# Altium schematic sheet MOSFETS.SchDoc
size 420 x 297 mm; PageSetup: Record=PageOptions|CenterHorizontal=False|CenterVertical=False|PrintScale=0.95|XCorrection=0.00|YCorrection=0.00|PrintKind=1|BorderSize=5000000|LeftOffset=0|BottomOffset=0|Orientation=1|PaperLength=1000|PaperWidth=1000|Scale=100|PaperSource=15|PrintQuality=600|MediaType=1|DitherType=10|PaperKind=A4|PrintScaleMode=1
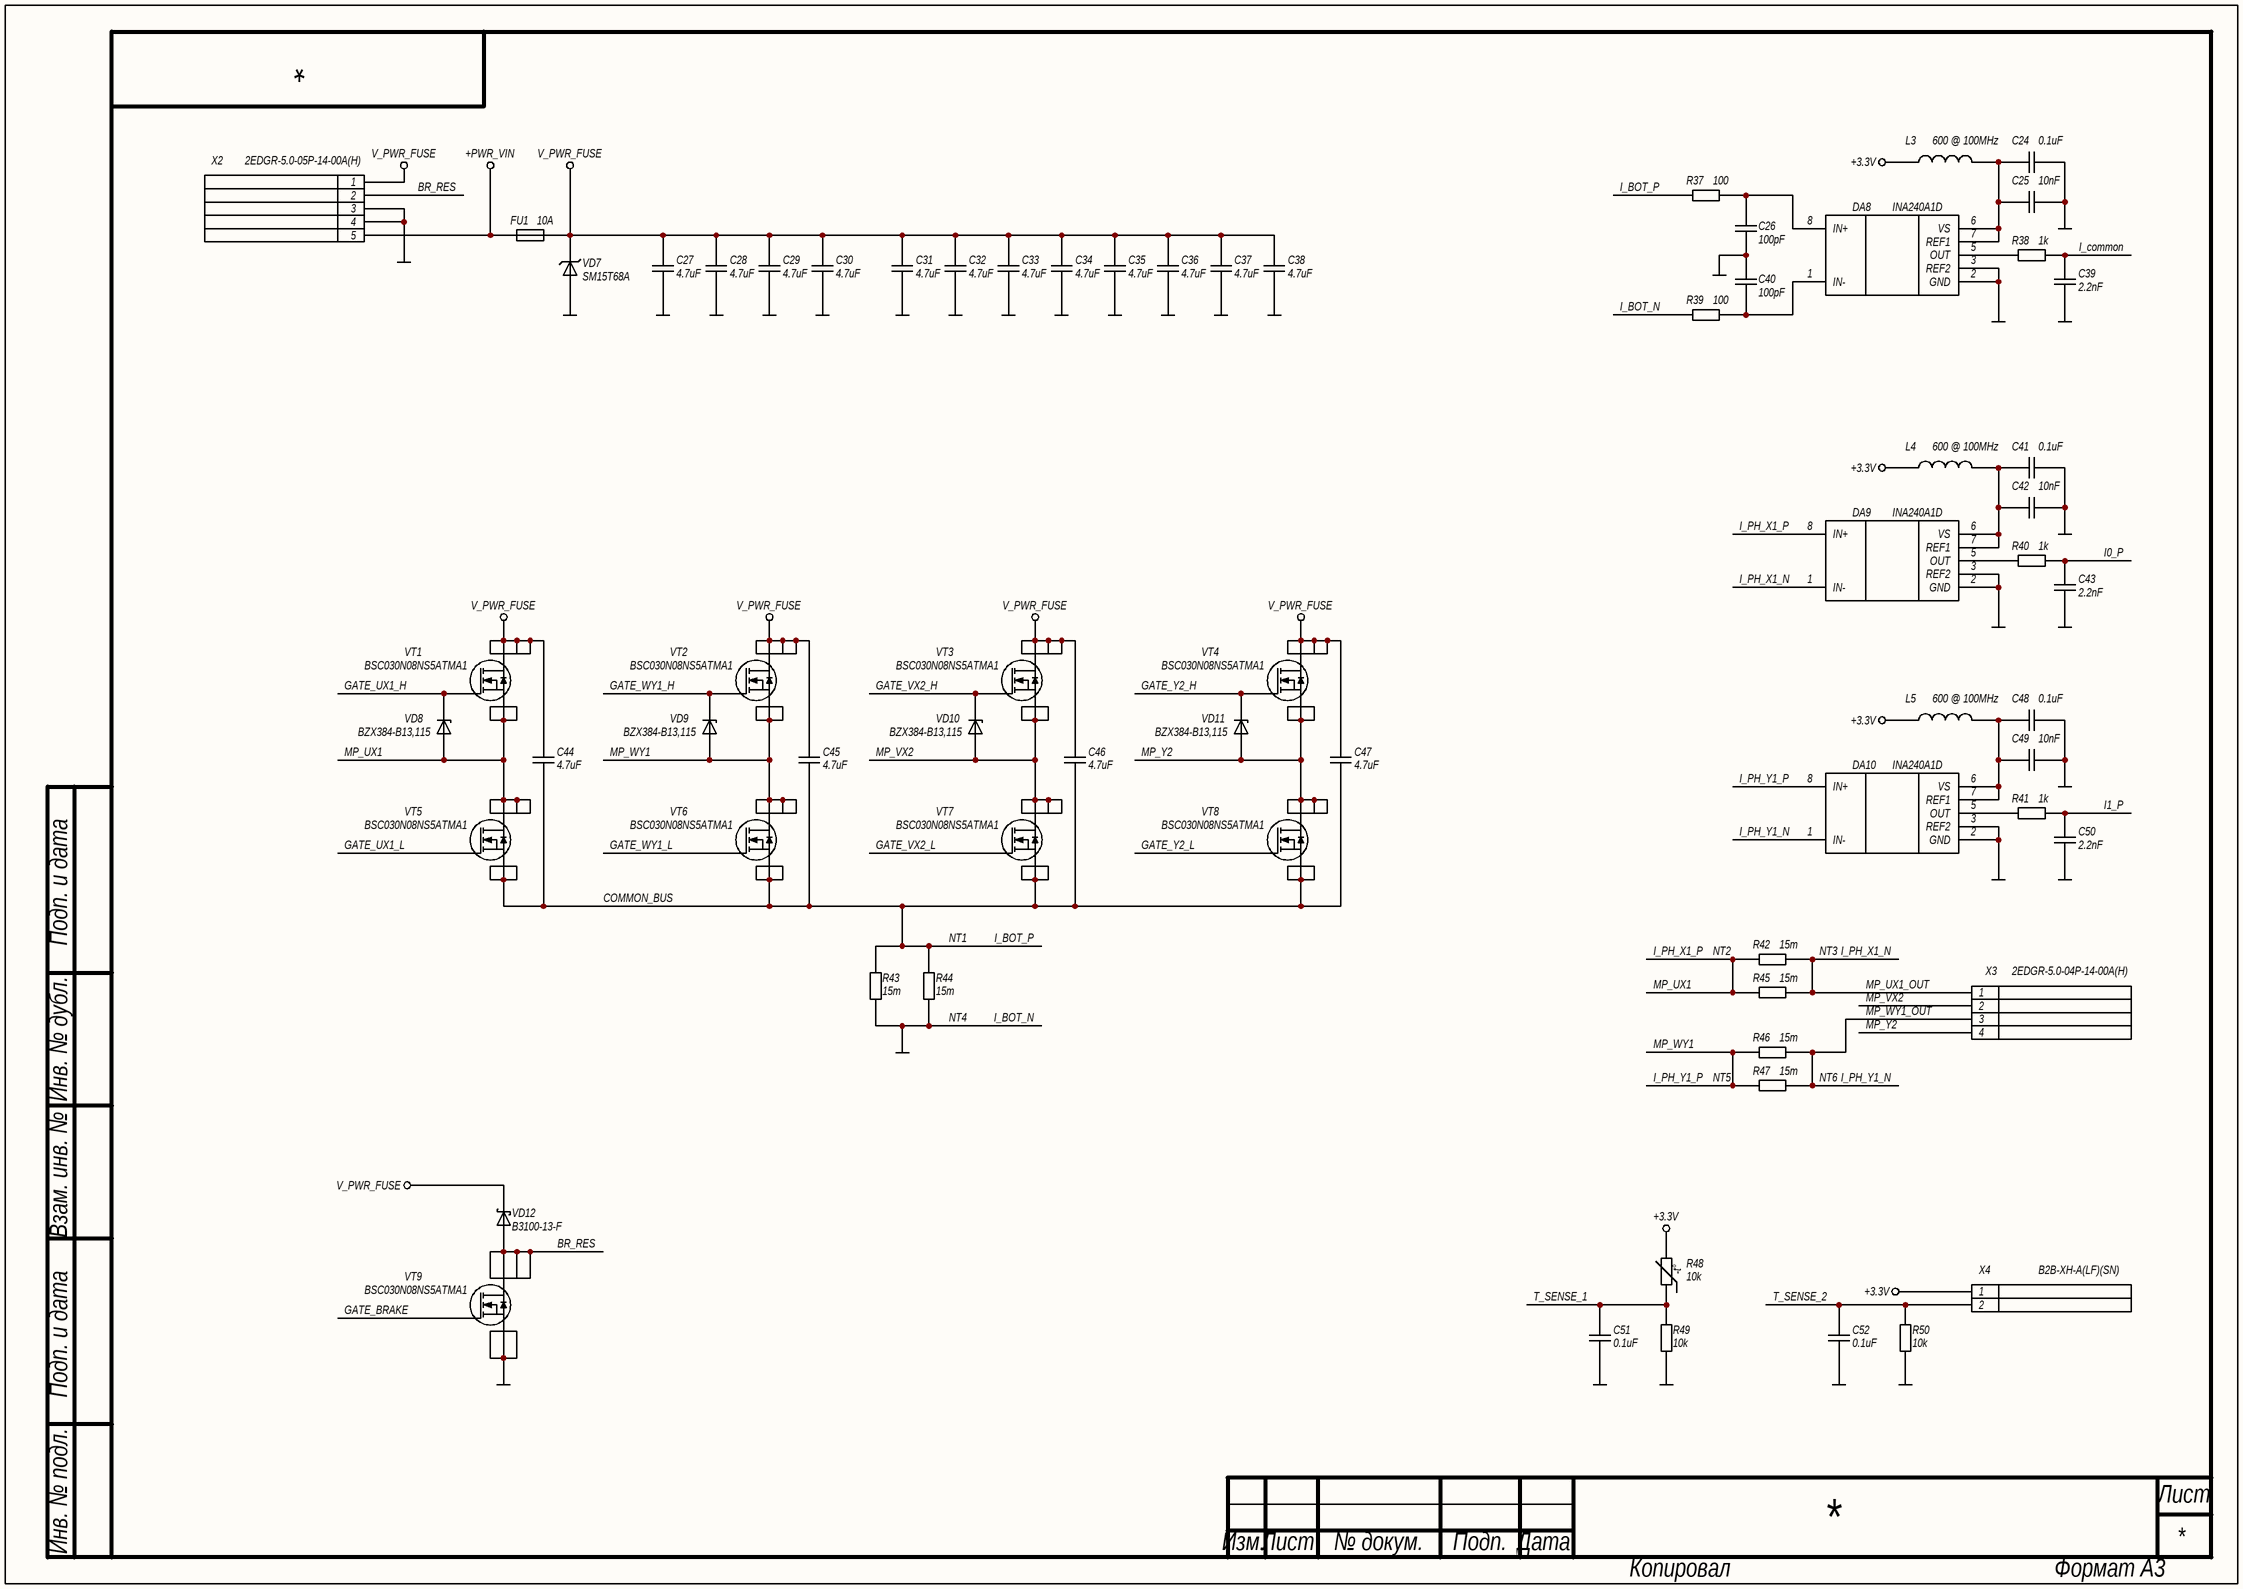
[diagram p0: MOSFETS.SchDoc]

## Parts
C24  0.1uF  [C0603N]
C25  10nF  [C0603N]
C26  100pF  [C0603N]
C27  4.7uF  [C1210N]
C28  4.7uF  [C1210N]
C29  4.7uF  [C1210N]
C30  4.7uF  [C1210N]
C31  4.7uF  [C1210N]
C32  4.7uF  [C1210N]
C33  4.7uF  [C1210N]
C34  4.7uF  [C1210N]
C35  4.7uF  [C1210N]
C36  4.7uF  [C1210N]
C37  4.7uF  [C1210N]
C38  4.7uF  [C1210N]
C39  2.2nF  [C0603N]
C40  100pF  [C0603N]
C41  0.1uF  [C0603N]
C42  10nF  [C0603N]
C43  2.2nF  [C0603N]
C44  4.7uF  [C1210N]
C45  4.7uF  [C1210N]
C46  4.7uF  [C1210N]
C47  4.7uF  [C1210N]
C48  0.1uF  [C0603N]
C49  10nF  [C0603N]
C50  2.2nF  [C0603N]
C51  0.1uF  [C0603N]
C52  0.1uF  [C0603N]
DA8  INA240A1D  [D0008A]
DA9  INA240A1D  [D0008A]
DA10  INA240A1D  [D0008A]
FU1  10A  [0154]
L3  600 @ 100MHz  [FB0603N]
L4  600 @ 100MHz  [FB0603N]
L5  600 @ 100MHz  [FB0603N]
NT1  NET_TIE  [NT_0.125_0.375]  (value not drawn)  (net tie, no BOM)
NT2  NET_TIE  [NT_0.125_0.375]  (value not drawn)  (net tie, no BOM)
NT3  NET_TIE  [NT_0.125_0.375]  (value not drawn)  (net tie, no BOM)
NT4  NET_TIE  [NT_0.125_0.375]  (value not drawn)  (net tie, no BOM)
NT5  NET_TIE  [NT_0.125_0.375]  (value not drawn)  (net tie, no BOM)
NT6  NET_TIE  [NT_0.125_0.375]  (value not drawn)  (net tie, no BOM)
R37  100  [R0603N]
R38  1k  [R0603N]
R39  100  [R0603N]
R40  1k  [R0603N]
R41  1k  [R0603N]
R42  15m  [R2512N]
R43  15m  [R2512N]
R44  15m  [R2512N]
R45  15m  [R2512N]
R46  15m  [R2512N]
R47  15m  [R2512N]
R48  10k  [RT0603N]
R49  10k  [R0603N]
R50  10k  [R0603N]
VD7  SM15T68A  [SMC]
VD8  BZX384-B13,115  [SOD323]
VD9  BZX384-B13,115  [SOD323]
VD10  BZX384-B13,115  [SOD323]
VD11  BZX384-B13,115  [SOD323]
VD12  B3100-13-F  [SMC]
VT1  BSC030N08NS5ATMA1  [PG-TDSON-8]
VT2  BSC030N08NS5ATMA1  [PG-TDSON-8]
VT3  BSC030N08NS5ATMA1  [PG-TDSON-8]
VT4  BSC030N08NS5ATMA1  [PG-TDSON-8]
VT5  BSC030N08NS5ATMA1  [PG-TDSON-8]
VT6  BSC030N08NS5ATMA1  [PG-TDSON-8]
VT7  BSC030N08NS5ATMA1  [PG-TDSON-8]
VT8  BSC030N08NS5ATMA1  [PG-TDSON-8]
VT9  BSC030N08NS5ATMA1  [PG-TDSON-8]
X2  2EDGR-5.0-05P-14-00A(H)  [2EDGR-5.0-05P-14-00A(H)]
X3  2EDGR-5.0-04P-14-00A(H)  [2EDGR-5.0-04P-14-00A(H)]
X4  B2B-XH-A(LF)(SN)  [B2B-XH-A]

## Nets
+3.3V: L3.1 L4.1 L5.1 R48.1 X4.1
+PWR_VIN: FU1.2 X2.5
GND: C24.1 C25.1 C26.2 C27.1 C28.1 C29.1 C30.1 C31.1 C32.1 C33.1 C34.1 C35.1 C36.1 C37.1 C38.1 C39.1 C40.1 C41.1 C42.1 C43.1 C48.1 C49.1 C50.1 C51.2 C52.2 DA8.2(GND) DA8.3(REF2) DA9.2(GND) DA9.3(REF2) DA10.2(GND) DA10.3(REF2) NT4.2 R43.2 R44.2 R49.2 R50.2 VD7.2(A) VT9.1(S) VT9.2(S) VT9.3(S) X2.3 X2.4
V_PWR_FUSE: C27.2 C28.2 C29.2 C30.2 C31.2 C32.2 C33.2 C34.2 C35.2 C36.2 C37.2 C38.2 C44.2 C45.2 C46.2 C47.2 FU1.1 VD7.1(K) VD12.1(K) VT1.5(D) VT1.6(D) VT1.7(D) VT1.8(D) VT2.5(D) VT2.6(D) VT2.7(D) VT2.8(D) VT3.5(D) VT3.6(D) VT3.7(D) VT3.8(D) VT4.5(D) VT4.6(D) VT4.7(D) VT4.8(D) X2.1
BR_RES: VD12.2(A) VT9.5(D) VT9.6(D) VT9.7(D) VT9.8(D) X2.2
COMMON_BUS: C44.1 C45.1 C46.1 C47.1 NT1.2 R43.1 R44.1 VT5.1(S) VT5.2(S) VT5.3(S) VT6.1(S) VT6.2(S) VT6.3(S) VT7.1(S) VT7.2(S) VT7.3(S) VT8.1(S) VT8.2(S) VT8.3(S)
GATE_BRAKE: VT9.4(G)
GATE_UX1_H: VD8.1(K) VT1.4(G)
GATE_UX1_L: VT5.4(G)
GATE_VX2_H: VD10.1(K) VT3.4(G)
GATE_VX2_L: VT7.4(G)
GATE_WY1_H: VD9.1(K) VT2.4(G)
GATE_WY1_L: VT6.4(G)
GATE_Y2_H: VD11.1(K) VT4.4(G)
GATE_Y2_L: VT8.4(G)
I0_P: C43.2 R40.1
I1_P: C50.2 R41.1
I_BOT_N: NT4.1 R39.2
I_BOT_P: NT1.1 R37.2
I_common: C39.2 R38.1
I_PH_X1_N: DA9.1(IN-) NT3.1
I_PH_X1_P: DA9.8(IN+) NT2.2
I_PH_Y1_N: DA10.1(IN-) NT6.1
I_PH_Y1_P: DA10.8(IN+) NT5.2
MP_UX1: NT2.1 R42.2 R45.2 VD8.2(A) VT1.1(S) VT1.2(S) VT1.3(S) VT5.5(D) VT5.6(D) VT5.7(D) VT5.8(D)
MP_UX1_OUT: NT3.2 R42.1 R45.1 X3.1
MP_VX2: VD10.2(A) VT3.1(S) VT3.2(S) VT3.3(S) VT7.5(D) VT7.6(D) VT7.7(D) VT7.8(D) X3.2
MP_WY1: NT5.1 R46.2 R47.2 VD9.2(A) VT2.1(S) VT2.2(S) VT2.3(S) VT6.5(D) VT6.6(D) VT6.7(D) VT6.8(D)
MP_WY1_OUT: NT6.2 R46.1 R47.1 X3.3
MP_Y2: VD11.2(A) VT4.1(S) VT4.2(S) VT4.3(S) VT8.5(D) VT8.6(D) VT8.7(D) VT8.8(D) X3.4
T_SENSE_1: C51.1 R48.2 R49.1
T_SENSE_2: C52.1 R50.1 X4.2
NetC24_2: C24.2 C25.2 DA8.6(VS) DA8.7(REF1) L3.2
NetC26_1: C26.1 DA8.8(IN+) R37.1
NetC40_2: C40.2 DA8.1(IN-) R39.1
NetC41_2: C41.2 C42.2 DA9.6(VS) DA9.7(REF1) L4.2
NetC48_2: C48.2 C49.2 DA10.6(VS) DA10.7(REF1) L5.2
NetDA8_5: DA8.5(OUT) R38.2
NetDA9_5: DA9.5(OUT) R40.2
NetDA10_5: DA10.5(OUT) R41.2

## Notes on the sheet
- Подп. и дата
- Инв. № дубл.
- Взам. инв. №
- Инв. № подл.
- Лист
- Изм.
- № докум.
- Подп.
- Дата
- Копировал
- Формат А3
- (in symbol NCP18XH103F03RB) -t°

## Library data of the parts
C24 C41 C48 C51 C52 = CL10B104KB8NNNC: Конденсатор; Точность: 10%; Напряжение: 50V; Диэлектрик: X7R; Производитель: Samsung Electro-Mechanics; Описание: 0.1 µF ±10% 50V Ceramic Capacitor X7R 0603 (1608 Metric); Корпус: 0603 (1608 Metric); Температурный диапазон: -55°C ~ 125°C; Вид монтажа: SMD; Артикул: CL10B104KB8NNNC; Номинал: 0.1uF; Строка для документации: https://mm.digikey.com/Volume0/opasdata/d220001/medias/docus/609/CL10B104KB8NNNC_Spec.pdf; Тип элемента: Конденсатор
C25 C42 C49 = CL10B103KB8NNNC: Конденсатор; Точность: 10%; Напряжение: 16V; Диэлектрик: X7R; Производитель: Samsung Electro-Mechanics; Описание: 10000 pF ±10% 50V Ceramic Capacitor X7R 0603 (1608 Metric); Корпус: 0603 (1608 Metric); Температурный диапазон: -55°C ~ 125°C; Вид монтажа: SMD; Артикул: CL10B103KB8NNNC; Номинал: 10nF; Строка для документации: https://mm.digikey.com/Volume0/opasdata/d220001/medias/docus/609/CL10B103KB8NNNC_Spec.pdf; Тип элемента: Конденсатор
C26 C40 = CL10C101JB8NNNC: Конденсатор; Точность: 5%; Напряжение: 50V; Диэлектрик: NP0; Производитель: Samsung Electro-Mechanics; Описание: 100 pF ±5% 50V Ceramic Capacitor C0G, NP0 0603 (1608 Metric); Корпус: 0603 (1608 Metric); Температурный диапазон: -55°C ~ 125°C; Вид монтажа: SMD; Артикул: CL10C101JB8NNNC; Номинал: 100pF; Строка для документации: https://mm.digikey.com/Volume0/opasdata/d220001/medias/docus/609/CL10C101JB8NNNC_Spec.pdf; Тип элемента: Конденсатор
C27-C38 C44-C47 = CL32B475KCVZW6E: Конденсатор; Точность: 10%; Напряжение: 100V; Диэлектрик: X7R; Производитель: Samsung Electro-Mechanics; Описание: 4.7 µF ±10% 100V Ceramic Capacitor X7R 1210 (3225 Metric); Корпус: 1210 (3225 Metric); Температурный диапазон: -55°C ~ 125°C; Вид монтажа: SMD; Артикул: CL32B475KCVZW6E; Номинал: 4.7uF; Строка для документации: https://www.samsungsem.com/resources/file/global/support/product_catalog/MLCC.pdf; Тип элемента: Конденсатор
C39 C43 C50 = CL10B222KB8NNNC: Конденсатор; Точность: 10%; Напряжение: 50V; Диэлектрик: X7R; Производитель: Samsung Electro-Mechanics; Описание: 2200 pF ±10% 50V Ceramic Capacitor X7R 0603 (1608 Metric); Корпус: 0603 (1608 Metric); Температурный диапазон: -55°C ~ 125°C; Вид монтажа: SMD; Артикул: CL10B222KB8NNNC; Номинал: 2.2nF; Тип элемента: Конденсатор
DA8-DA10 = INA240A1D: Микросхема усилитель сигнала токового шунта; Производитель: Texas Instruments; Описание: Current Sense Amplifier 1 Circuit 8-SOIC; Корпус: 8-SOIC (0.154", 3.90mm Width); Температурный диапазон: -40°C ~ 125°C; Вид монтажа: SMD; Артикул: INA240A1D; Строка для документации: https://www.ti.com/lit/ds/symlink/ina240.pdf; Тип элемента: Микросхема
FU1 = 0154010.DR: Плавкий предохранитель; Тип: Fuse Holder Assembly; Производитель: Littelfuse Inc.; Описание: 10 A 125 V AC 125 V DC Fuse Board Mount (Cartridge Style Excluded) Requires Holder, Surface Mount 2-SMD, Square End Block with Holder; Корпус: 9.73mm x 5.03mm x 3.81mm; Температурный диапазон: -55°C ~ 125°C; Вид монтажа: SMD; Артикул: 0154010.DR; Ток: 10A; Строка для документации: https://www.littelfuse.com/~/media/electronics/datasheets/fuses/littelfuse_fuse_154_154t_154l_154tl_datasheet.pdf.pdf; Тип элемента: Предохранитель
L3-L5 = BLM18AG601SN1D: Фильтр ЭМП индуктивный; Ток: 500mA; Сопротивление: 380m; Тип: Ferrite Bead; Производитель: Murata Electronics; Описание: 600 Ohms @ 100 MHz 1 Ferrite Bead 0603 (1608 Metric) 500mA 380mOhm; Корпус: 0603 (1608 Metric); Температурный диапазон: -55°C ~ 125°C; Вид монтажа: SMD; Артикул: BLM18AG601SN1D; Номинал: 600 @ 100MHz; Строка для документации: https://www.murata.com/en-us/products/productdata/8796738650142/ENFA0003.pdf; Тип элемента: Фильтр ЭМП
NT1-NT6 = Net Tie, 0.125mm width, 0.375mm length: Соединитель цепей (Net Tie); Тип: Net Tie; Тип элемента: Другое; Артикул: Net Tie, 0.125mm width, 0.375mm length; Описание: Net Tie, 0.125mm width, 0.375mm length
R37 R39 = RC0603FR-07100RL: Резистор; Точность: 1%; ТКС: ±100ppm/°C; Напряжение: 75V; Производитель: YAGEO; Описание: 100 Ohms ±1% 0.1W, 1/10W Chip Resistor 0603 (1608 Metric) Moisture Resistant Thick Film; Корпус: 0603 (1608 Metric); Температурный диапазон: -55°C ~ 155°C; Вид монтажа: SMD; Артикул: RC0603FR-07100RL; Номинал: 100; Строка для документации: https://www.yageo.com/upload/media/product/app/datasheet/rchip/pyu-rc_group_51_rohs_l.pdf; Тип элемента: Резистор
R38 R40 R41 = RC0603FR-071KL: Резистор; Точность: 1%; ТКС: ±100ppm/°C; Напряжение: 75V; Производитель: YAGEO; Описание: 1 kOhms ±1% 0.1W, 1/10W Chip Resistor 0603 (1608 Metric) Moisture Resistant Thick Film; Корпус: 0603 (1608 Metric); Температурный диапазон: -55°C ~ 155°C; Вид монтажа: SMD; Артикул: RC0603FR-071KL; Номинал: 1k; Строка для документации: https://www.yageo.com/upload/media/product/app/datasheet/rchip/pyu-rc_group_51_rohs_l.pdf; Тип элемента: Резистор
R42-R47 = CRA2512-FZ-R015ELF: Резистор; Точность: 1%; ТКС: ±50ppm/°C; Производитель: Bourns Inc.; Описание: 15 mOhms ±1% 3W Chip Resistor 2512 (6432 Metric) Automotive AEC-Q200, Current Sense, Moisture Resistant Metal Element; Корпус: 2512 (6432 Metric); Температурный диапазон: -55°C ~ 170°C; Вид монтажа: SMD; Артикул: CRA2512-FZ-R015ELF; Номинал: 15m; Строка для документации: https://www.bourns.com/docs/product-datasheets/cra.pdf; Тип элемента: Резистор
R48 = NCP18XH103F03RB: Резистор; Точность: 1%; Производитель: Murata Electronics; Описание: NTC Thermistor 10k 0603 (1608 Metric); Корпус: 0603 (1608 Metric); Температурный диапазон: -40°C ~ 125°C; Вид монтажа: SMD; Артикул: NCP18XH103F03RB; Номинал: 10k; Строка для документации: https://www.murata.com/en-us/api/pdfdownloadapi?cate=luNTCforTempeSenso&partno=NCP18XH103F03RB; Тип элемента: Резистор
R49 R50 = RC0603FR-0710KL: Резистор; Точность: 1%; ТКС: ±100ppm/°C; Напряжение: 75V; Производитель: YAGEO; Описание: 10 kOhms ±1% 0.1W, 1/10W Chip Resistor 0603 (1608 Metric) Moisture Resistant Thick Film; Корпус: 0603 (1608 Metric); Температурный диапазон: -55°C ~ 155°C; Вид монтажа: SMD; Артикул: RC0603FR-0710KL; Номинал: 10k; Строка для документации: https://www.yageo.com/upload/media/product/app/datasheet/rchip/pyu-rc_group_51_rohs_l.pdf; Тип элемента: Резистор
VD7 = SM15T68A: TVS диод однонаправлвенный; Напряжение: 58.1V; Напряжение ограничения: 121V; Напряжение пробоя: 64.6V; Ток: 83A; Тип: TVS Unidirectional; Производитель: STMicroelectronics; Описание: 121V Clamp 83A (8/20µs) Ipp Tvs Diode Surface Mount SMC; Корпус: DO-214AB, SMC; Температурный диапазон: -55°C ~ 150°C (TJ); Вид монтажа: SMD; Тип элемента: Диод защитный; Артикул: SM15T68A; Строка для документации: https://www.st.com/content/ccc/resource/technical/document/datasheet/a5/63/bb/0d/f0/b8/44/65/CD00000724.pdf/files/CD00000724.pdf/jcr:content/translations/en.CD00000724.pdf
VD8-VD11 = BZX384-B13,115: Стабилитрон; Прямой ток: 5mA; Напряжение: 13V; Производитель: Nexperia USA Inc.; Описание: Zener Diode 13 V 300 mW ±2% Surface Mount SOD-323; Корпус: SOD-323; Температурный диапазон: -65°C ~ 150°C; Вид монтажа: SMD; Тип элемента: Диод; Артикул: BZX384-B13,115; Тип: Zener; Строка для документации: https://assets.nexperia.com/documents/data-sheet/BZX384_SER.pdf
VD12 = B3100-13-F: Диод Шоттки; Прямой ток: 3A; Напряжение: 100V; Производитель: Diodes Incorporated; Описание: Diode 100 V 3A Surface Mount SMC; Корпус: DO-214AB, SMC; Температурный диапазон: -55°C ~ 125°C; Вид монтажа: SMD; Артикул: B3100-13-F; Тип: Schottky; Строка для документации: https://mm.digikey.com/Volume0/opasdata/d220001/medias/docus/797/B370-B3100.pdf; Тип элемента: Диод
VT1-VT9 = BSC030N08NS5ATMA1: МОП транзистор, N-канальный; Ток: 100A (Tc); Напряжение: 80V; Сопротивление канала: 3m; Пороговое напряжение: 3V; Тип: N-MOSFET; Производитель: Infineon Technologies; Описание: N-Channel 80 V 100A (Tc) 2.5W (Ta), 139W (Tc) Surface Mount PG-TDSON-8-7; Температурный диапазон: -55°C ~ 150°C (TJ); Вид монтажа: SMD; Тип элемента: Транзистор полевой; Артикул: BSC030N08NS5ATMA1; Корпус: PG-TDSON-8; Строка для документации: https://www.infineon.com/dgdl/Infineon-BSC030N08NS5-DS-v02_02-EN.pdf?fileId=5546d4624ad04ef9014aed52f4210acf
X2 = 2EDGR-5.0-05P-14-00A(H): Разъем, 5 контактов; Тип разъема: Pluggable terminal block; Количество контактов: 5; Шаг контактов: 5mm; Ток: 20A; Напряжение: 320V; Производитель: Degson Electronics; Описание: Pluggable terminal block; 5.0mm; ways: 5; angled 90; socket; male; Температурный диапазон: -40°C ~ 105°C; Вид монтажа: Through Hole; Артикул: 2EDGR-5.0-05P-14-00A(H); Строка для документации: https://www.tme.eu/Document/aee9e19a2094185fa8ff38cbebedb2f3/2EDGR-5.0.pdf; Тип элемента: Разъем
X3 = 2EDGR-5.0-04P-14-00A(H): Разъем, 4 контакта; Тип разъема: Pluggable terminal block; Количество контактов: 4; Шаг контактов: 5mm; Ток: 20A; Напряжение: 320V; Производитель: Degson Electronics; Описание: Pluggable terminal block; 5.0mm; ways: 4; angled 90; socket; male; Температурный диапазон: -40°C ~ 105°C; Вид монтажа: Through Hole; Артикул: 2EDGR-5.0-04P-14-00A(H); Строка для документации: https://www.tme.eu/Document/aee9e19a2094185fa8ff38cbebedb2f3/2EDGR-5.0.pdf; Тип элемента: Разъем
X4 = B2B-XH-A(LF)(SN): Разъем, 2 контакта; Тип разъема: Header, Male Pin; Количество контактов: 2; Шаг контактов: 2.5mm; Ток: 3A; Напряжение: 250V; Производитель: JST Sales America Inc.; Описание: Connector Header Through Hole 2 position 0.098" (2.50mm); Температурный диапазон: -25°C ~ 85°C; Вид монтажа: Through Hole; Артикул: B2B-XH-A(LF)(SN); Строка для документации: https://www.jst-mfg.com/product/pdf/eng/eXH.pdf; Тип элемента: Разъем